# Altium schematic sheet BridgeSensors.SchDoc: Top Sheet
size Legal; DocumentNumber: 4; SheetNumber: 4; SheetTotal: 8; Project: World Domination Satellite
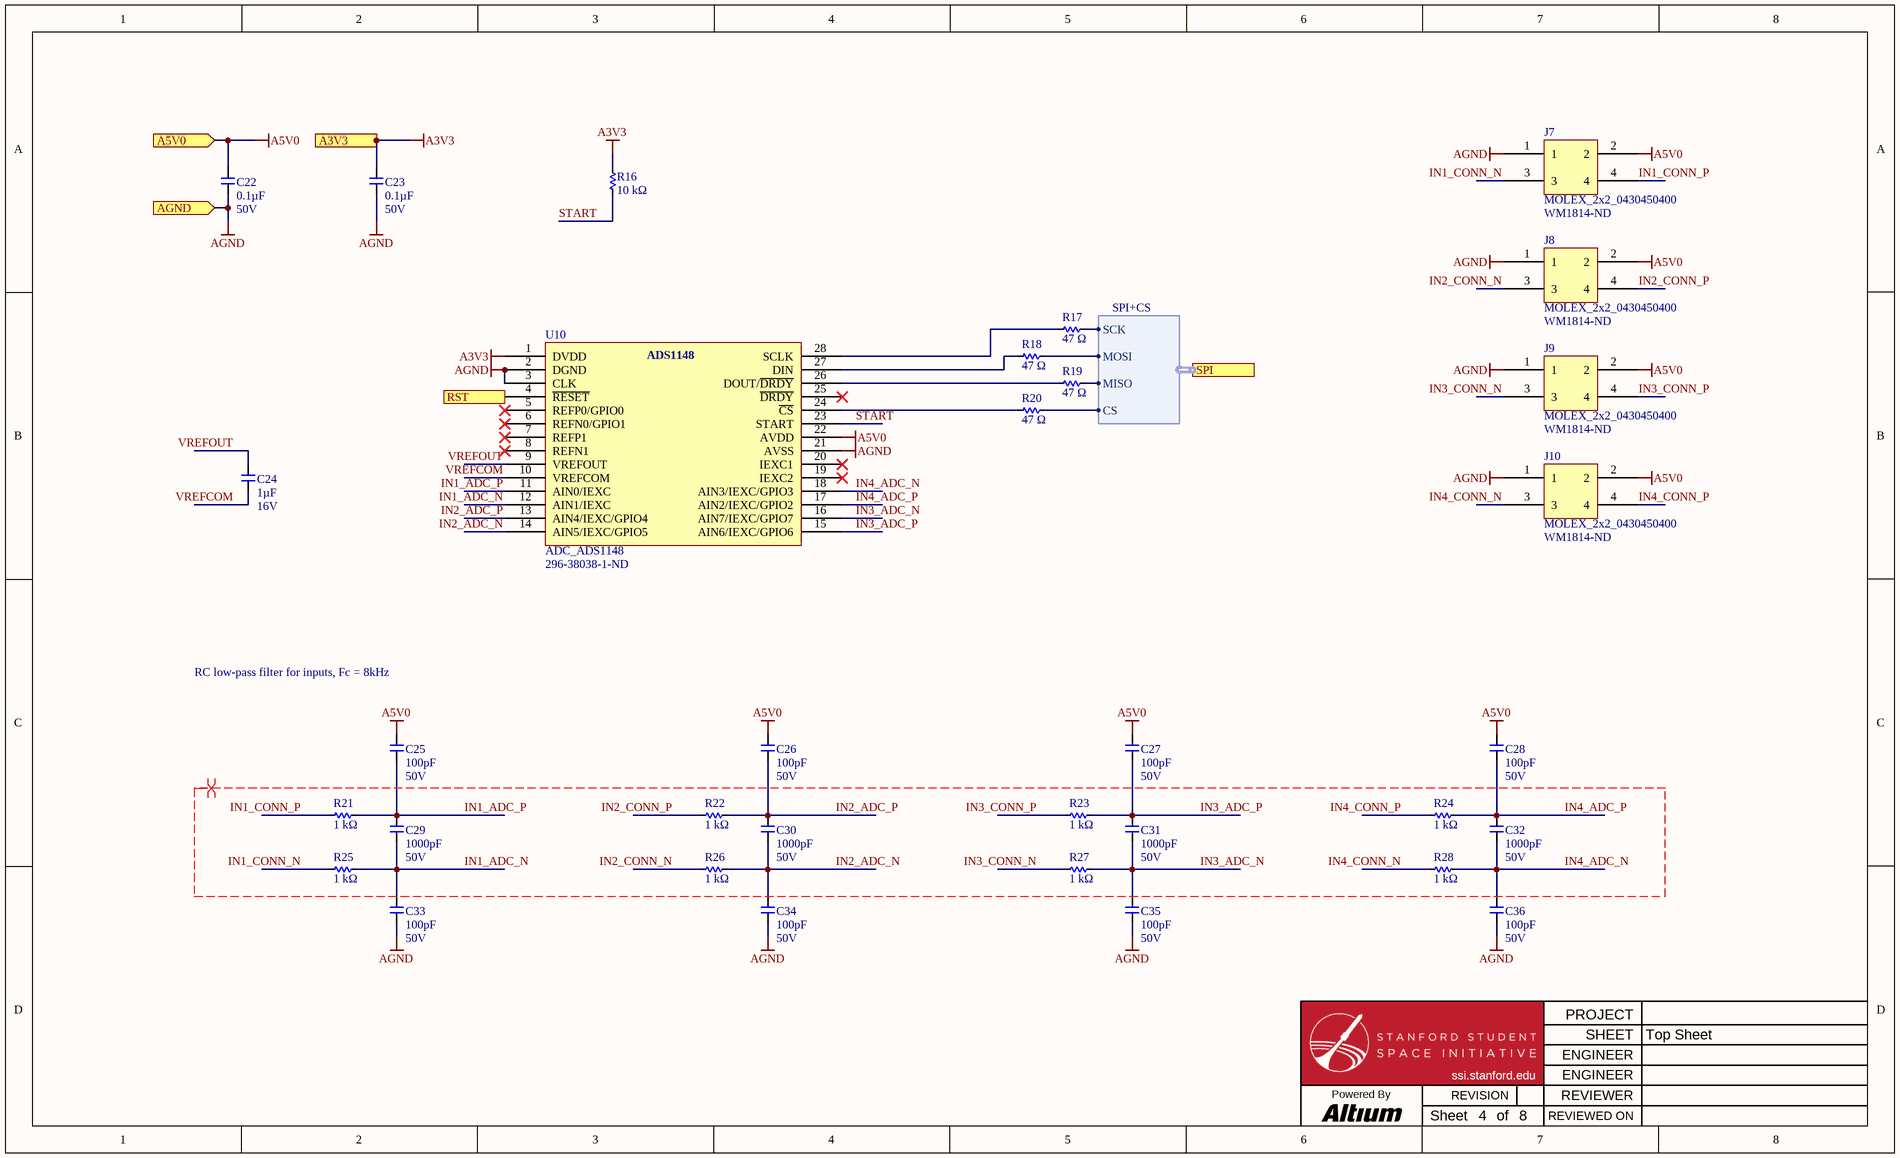
[diagram p0: BridgeSensors.SchDoc]

## Parts
C22  Capacitance (shorthand): 0.1µF  Rated Voltage: 50V  [C0603]  (hidden comment: __template_cap)
C23  Capacitance (shorthand): 0.1µF  Rated Voltage: 50V  [C0603]  (hidden comment: __template_cap)
C24  Capacitance (shorthand): 1µF  Rated Voltage: 16V  [C0603]  (hidden comment: __template_cap)
C25  Capacitance (shorthand): 100pF  Rated Voltage: 50V  [C0603]  (hidden comment: __template_cap)
C26  Capacitance (shorthand): 100pF  Rated Voltage: 50V  [C0603]  (hidden comment: __template_cap)
C27  Capacitance (shorthand): 100pF  Rated Voltage: 50V  [C0603]  (hidden comment: __template_cap)
C28  Capacitance (shorthand): 100pF  Rated Voltage: 50V  [C0603]  (hidden comment: __template_cap)
C29  Capacitance (shorthand): 1000pF  Rated Voltage: 50V  [C0603]  (hidden comment: __template_cap)
C30  Capacitance (shorthand): 1000pF  Rated Voltage: 50V  [C0603]  (hidden comment: __template_cap)
C31  Capacitance (shorthand): 1000pF  Rated Voltage: 50V  [C0603]  (hidden comment: __template_cap)
C32  Capacitance (shorthand): 1000pF  Rated Voltage: 50V  [C0603]  (hidden comment: __template_cap)
C33  Capacitance (shorthand): 100pF  Rated Voltage: 50V  [C0603]  (hidden comment: __template_cap)
C34  Capacitance (shorthand): 100pF  Rated Voltage: 50V  [C0603]  (hidden comment: __template_cap)
C35  Capacitance (shorthand): 100pF  Rated Voltage: 50V  [C0603]  (hidden comment: __template_cap)
C36  Capacitance (shorthand): 100pF  Rated Voltage: 50V  [C0603]  (hidden comment: __template_cap)
J7  MOLEX_2x2_0430450400  Supplier Part Number 1: WM1814-ND  [MOLEX_2x2_0430450400]
J8  MOLEX_2x2_0430450400  Supplier Part Number 1: WM1814-ND  [MOLEX_2x2_0430450400]
J9  MOLEX_2x2_0430450400  Supplier Part Number 1: WM1814-ND  [MOLEX_2x2_0430450400]
J10  MOLEX_2x2_0430450400  Supplier Part Number 1: WM1814-ND  [MOLEX_2x2_0430450400]
R16  Resistance: 10 kΩ  [R0603]  (hidden comment: __template_resistor)
R17  Resistance: 47 Ω  [R0603]  (hidden comment: __template_resistor)
R18  Resistance: 47 Ω  [R0603]  (hidden comment: __template_resistor)
R19  Resistance: 47 Ω  [R0603]  (hidden comment: __template_resistor)
R20  Resistance: 47 Ω  [R0603]  (hidden comment: __template_resistor)
R21  Resistance: 1 kΩ  [R0603]  (hidden comment: __template_resistor)
R22  Resistance: 1 kΩ  [R0603]  (hidden comment: __template_resistor)
R23  Resistance: 1 kΩ  [R0603]  (hidden comment: __template_resistor)
R24  Resistance: 1 kΩ  [R0603]  (hidden comment: __template_resistor)
R25  Resistance: 1 kΩ  [R0603]  (hidden comment: __template_resistor)
R26  Resistance: 1 kΩ  [R0603]  (hidden comment: __template_resistor)
R27  Resistance: 1 kΩ  [R0603]  (hidden comment: __template_resistor)
R28  Resistance: 1 kΩ  [R0603]  (hidden comment: __template_resistor)
U10  ADC_ADS1148  Supplier Part Number 1: 296-38038-1-ND  [28TSSOP65]

## Ports
A3V3 (in), A5V0 (in), AGND (in), RST (in), SPI (harness SPI+CS)

## Harnesses
SPI+CS: SCK, MOSI, MISO, CS

## Nets
A3V3: C23.1 R16.2 U10.1(DVDD) ; port A3V3
A5V0: C22.1 C25.2 C26.2 C27.2 C28.2 J7.2 J8.2 J9.2 J10.2 U10.22(AVDD) ; port A5V0
AGND: C22.2 C23.2 C33.2 C34.2 C35.2 C36.2 J7.1 J8.1 J9.1 J10.1 U10.2(DGND) U10.3(CLK) U10.21(AVSS) ; port AGND
IN1_ADC_N: C29.1 C33.1 R25.2 U10.12(AIN1/IEXC)
IN1_ADC_P: C25.1 C29.2 R21.2 U10.11(AIN0/IEXC)
IN1_CONN_N: J7.3 R25.1
IN1_CONN_P: J7.4 R21.1
IN2_ADC_N: C30.1 C34.1 R26.2 U10.14(AIN5/IEXC/GPIO5)
IN2_ADC_P: C26.1 C30.2 R22.2 U10.13(AIN4/IEXC/GPIO4)
IN2_CONN_N: J8.3 R26.1
IN2_CONN_P: J8.4 R22.1
IN3_ADC_N: C31.1 C35.1 R27.2 U10.16(AIN7/IEXC/GPIO7)
IN3_ADC_P: C27.1 C31.2 R23.2 U10.15(AIN6/IEXC/GPIO6)
IN3_CONN_N: J9.3 R27.1
IN3_CONN_P: J9.4 R23.1
IN4_ADC_N: C32.1 C36.1 R28.2 U10.18(AIN3/IEXC/GPIO3)
IN4_ADC_P: C28.1 C32.2 R24.2 U10.17(AIN2/IEXC/GPIO2)
IN4_CONN_N: J10.3 R28.1
IN4_CONN_P: J10.4 R24.1
RST: U10.4(~{RESET}) ; port RST
START: R16.1 U10.23(START)
VREFCOM: C24.2 U10.10(VREFCOM)
VREFOUT: C24.1 U10.9(VREFOUT)
NetR17_1: R17.1 U10.28(SCLK)
NetR17_2: R17.2 ; port SPI.SCK
NetR18_1: R18.1 U10.27(DIN)
NetR18_2: R18.2 ; port SPI.MOSI
NetR19_1: R19.1 U10.26(DOUT/~{DRDY})
NetR19_2: R19.2 ; port SPI.MISO
NetR20_1: R20.1 U10.24(~{CS})
NetR20_2: R20.2 ; port SPI.CS

Not connected (* = marked no-connect by the designer): U10 5(REFP0/GPIO0)* 6(REFN0/GPIO1)* 7(REFP1)* 8(REFN1)* 19(IEXC2)* 20(IEXC1)* 25(~{DRDY})*

## Layout directives
differential pair: IN1_ADC_N, IN1_ADC_P, IN1_CONN_N, IN1_CONN_P, IN2_ADC_N, IN2_ADC_P, IN2_CONN_N, IN2_CONN_P, IN3_ADC_N, IN3_ADC_P, IN3_CONN_N, IN3_CONN_P, IN4_ADC_N, IN4_ADC_P, IN4_CONN_N, IN4_CONN_P

## Notes on the sheet
- RC low-pass filter for inputs, Fc = 8kHz
- PROJECT
- SHEET
- Powered By
- Sheet
- of
- REVISION
- ssi.stanford.edu
- ENGINEER
- REVIEWER
- REVIEWED ON
- (in symbol ADC_ADS1148) ADS1148

## Library data of the parts
C22 C23 = 490-1519-1-ND: CAP CER 0603 0.1µF X7R 50V 10%; Manufacturer: Murata Electronics North America; Capacitance - pF (Machine readable): 100000; type: capacitor; Supplier Part Number 1: 490-1519-1-ND; Dielectric: X7R; Supplier 1: Digikey
C24 = 490-3900-1-ND: CAP CER 0603 1µF X7R 16V 10%; Manufacturer: Murata Electronics North America; Capacitance - pF (Machine readable): 1000000; type: capacitor; Supplier Part Number 1: 490-3900-1-ND; Dielectric: X7R; Supplier 1: Digikey
C25-C28 C33-C36 = 490-1427-1-ND: CAP CER 100PF 50V C0G/NP0 0603; Manufacturer: Murata Electronics North America; Capacitance - pF (Machine readable): 100; type: capacitor; Dielectric: C0G, NP0; Supplier Part Number 1: 490-1427-1-ND; Supplier 1: Digikey
C29-C32 = 490-1494-1-ND: CAP CER 0603 1000pF X7R 50V 10%; Manufacturer: Murata Electronics North America; Capacitance - pF (Machine readable): 1000; type: capacitor; Supplier Part Number 1: 490-1494-1-ND; Dielectric: X7R; Supplier 1: Digikey
J7-J10 = MOLEX_2x2_0430450400: MICROFIT CONN HEADER R/A 4POS 3MM; Supplier 1: Digi-Key
R16 = RES SMD 10K OHM 1% 1/10W 0603: Manufacturer Part Number: RC0603FR-0710KL; Manufacturer: Yageo; Resistance (Sortable): 10000; Power (Watts): 0.1W, 1/10W; Temperature Coefficient: ±100ppm/°C; Supplier 1: Digikey; Datasheets: http://www.yageo.com/documents/recent/PYu-RC_Group_51_RoHS_L_9.pdf; Image: //media.digikey.com/Renders/Yageo%20Renders/0603-(1608-Metric).jpg; Supplier Part Number 1: 311-10.0KHRCT-ND; Tolerance: ±1%; Operating Temperature: -55°C ~ 155°C
R17-R20 = RES SMD 47 OHM 1% 1/10W 0603: Manufacturer Part Number: RC0603FR-0747RL; Manufacturer: Yageo; Resistance (Sortable): 47; Power (Watts): 0.1W, 1/10W; Temperature Coefficient: ±100ppm/°C; Supplier 1: Digikey; Datasheets: http://www.yageo.com/documents/recent/PYu-RC_Group_51_RoHS_L_9.pdf; Image: //media.digikey.com/Renders/Yageo%20Renders/0603-(1608-Metric).jpg; Supplier Part Number 1: 311-47.0HRCT-ND; Tolerance: ±1%; Operating Temperature: -55°C ~ 155°C
R21-R28 = RES SMD 1K OHM 1% 1/10W 0603: Manufacturer Part Number: RC0603FR-071KL; Manufacturer: Yageo; Resistance (Sortable): 1000; Power (Watts): 0.1W, 1/10W; Temperature Coefficient: ±100ppm/°C; Supplier 1: Digikey; Datasheets: http://www.yageo.com/documents/recent/PYu-RC_Group_51_RoHS_L_9.pdf; Image: //media.digikey.com/Renders/Yageo%20Renders/0603-(1608-Metric).jpg; Supplier Part Number 1: 311-1.00KHRCT-ND; Tolerance: ±1%; Operating Temperature: -55°C ~ 155°C
U10 = ADC_ADS1148: IC ADC 16BIT SRL 2KSPS 28TSSOP; Supplier 1: Digi-Key